# EAGLE design immo_programmer (EAGLE 9.6.2)
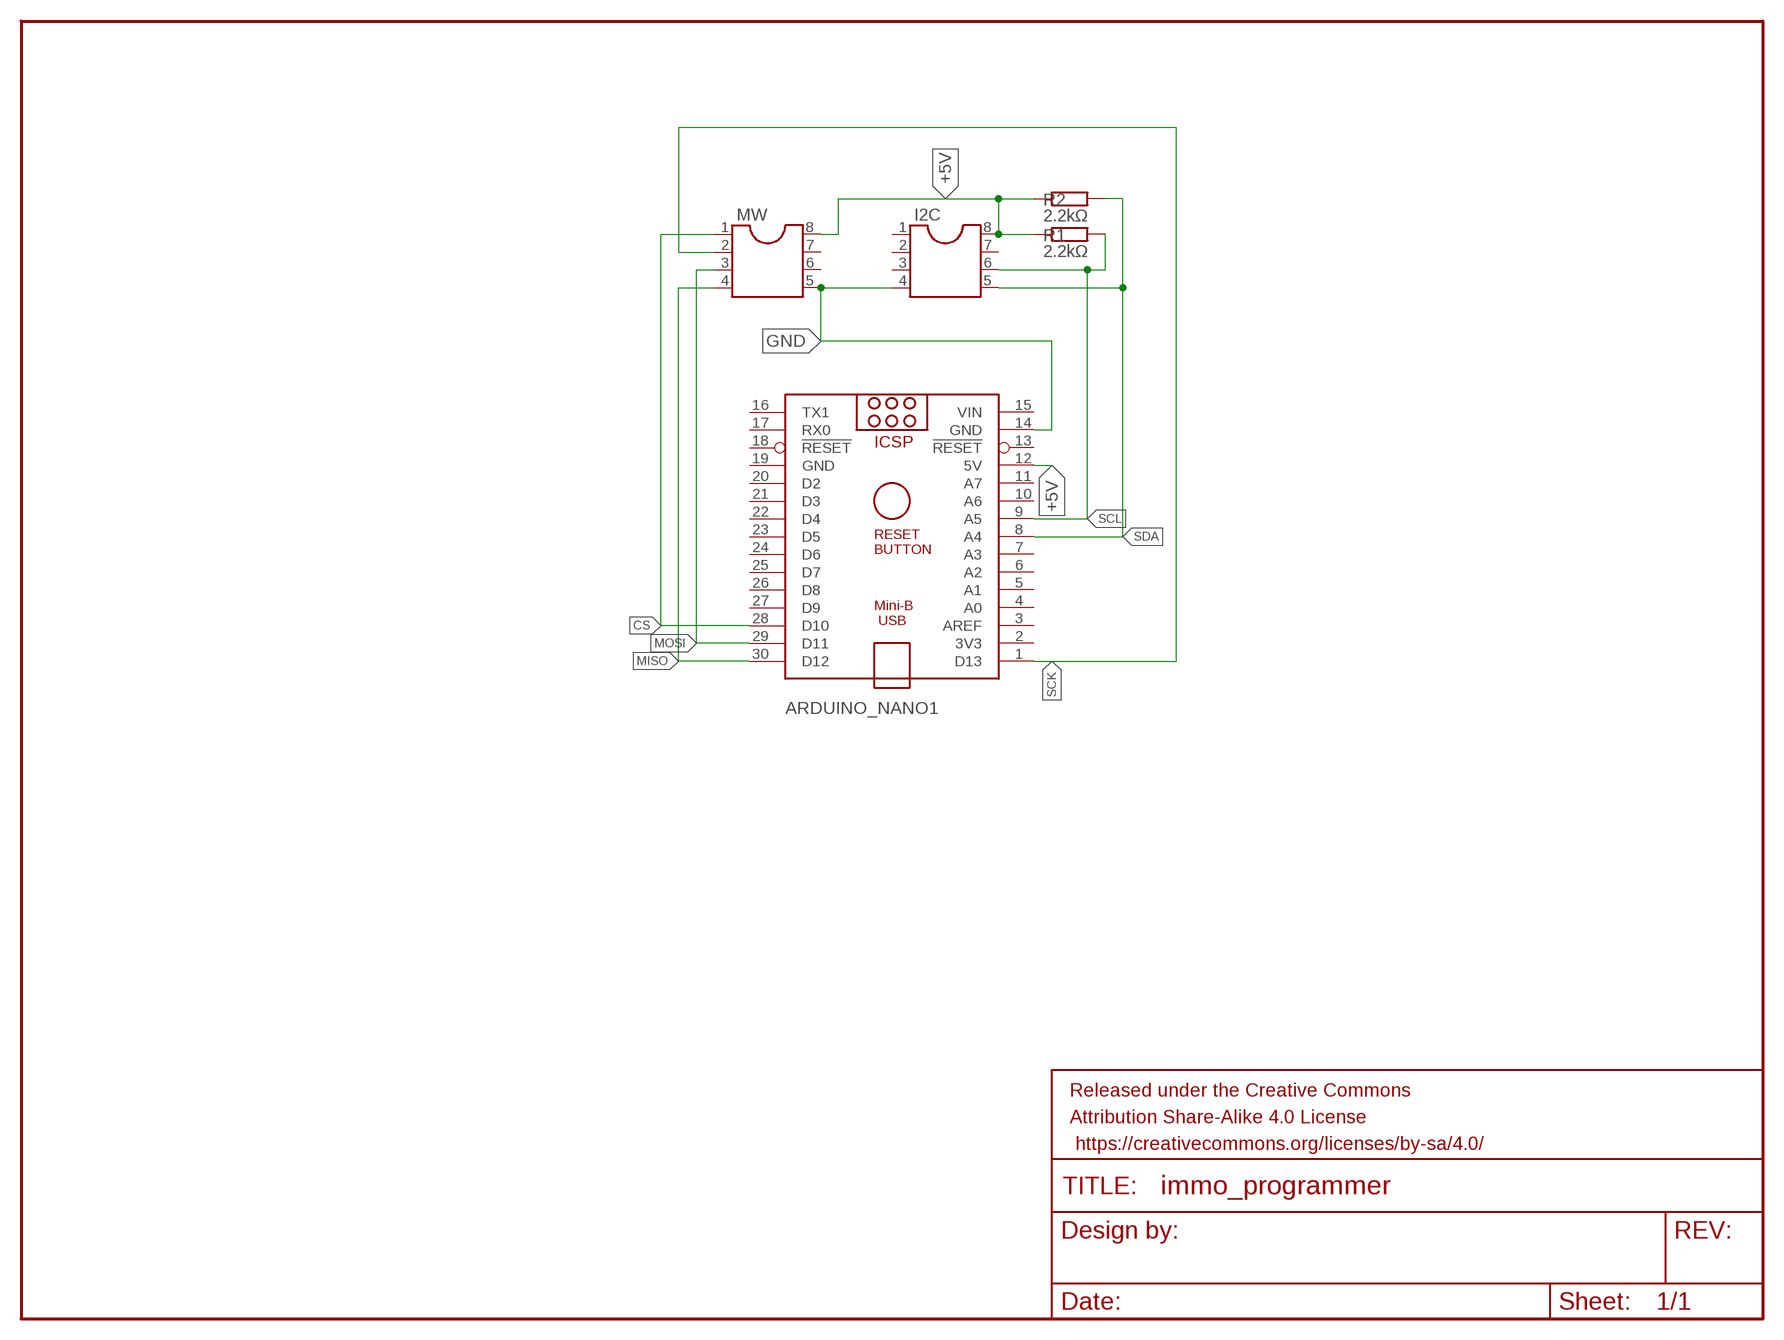
[diagram p0: schematic, sheet 1]

## Parts
ARDUINO_NANO1  ARDUINO_NANO  [ARDUINO_NANO]
FRAME1  FRAME-LETTER  [CREATIVE_COMMONS]
I2C  DIL8  [DIL08]
MW  DIL8  [DIL08]
R1  2.2kΩ  R0207/10  [0207/10]
R2  2.2kΩ  R0207/10  [0207/10]

## Nets
+5V: ARDUINO_NANO1.12(5V) I2C.8 MW.8 R1.1 R2.1
CS: ARDUINO_NANO1.28(D10) MW.1
GND: ARDUINO_NANO1.14(GND) I2C.4 MW.5
MISO: ARDUINO_NANO1.30(D12) MW.4
MOSI: ARDUINO_NANO1.29(D11) MW.3
SCK: ARDUINO_NANO1.1(D13) MW.2
SCL: ARDUINO_NANO1.9(A5) I2C.6 R1.2
SDA: ARDUINO_NANO1.8(A4) I2C.5 R2.2
Unconnected: ARDUINO_NANO1.2(3V3) ARDUINO_NANO1.3(AREF) ARDUINO_NANO1.4(A0) ARDUINO_NANO1.5(A1) ARDUINO_NANO1.6(A2) ARDUINO_NANO1.7(A3) ARDUINO_NANO1.10(A6) ARDUINO_NANO1.11(A7) ARDUINO_NANO1.13(!RESET) ARDUINO_NANO1.16(TX1) ARDUINO_NANO1.17(RX0) ARDUINO_NANO1.18(!RESET) ARDUINO_NANO1.20(D2) ARDUINO_NANO1.21(D3) ARDUINO_NANO1.22(D4) ARDUINO_NANO1.23(D5) ARDUINO_NANO1.24(D6) ARDUINO_NANO1.25(D7) ARDUINO_NANO1.26(D8) ARDUINO_NANO1.27(D9) I2C.1 I2C.2 I2C.3 I2C.7 MW.6 MW.7

## Power pins joined to a net without a drawn wire
GND: ARDUINO_NANO1.19(GND)
VIN: ARDUINO_NANO1.15(VIN)

## Library data of the parts
ARDUINO_NANO1 = ArduinoNanoV30:ARDUINO_NANO: Arduino Nano V3.0 Overview: The Arduino Nano is a small, complete, and breadboard-friendly board based on the ATmega328 (Arduino Nano 3.x) or ATmega168 (Arduino Nano 2.x). It has more or less the same functionality of the Arduino Duemilanove, but in a different package. It lacks only a DC power jack, and works with a Mini-B USB cable instead of a standard one. The Nano was designed and is being produced by Gravitech. Specifications: Microcontroller Atmel ATmega168 or ATmega328 Operating Voltage (logic level) 5 V Input Voltage (recommended) 7-12 V Input Voltage (limits) 6-20 V Digital I/O Pins 14 (of which 6 provide PWM output) Analog Input Pins 8 DC Current per I/O Pin 40 mA Flash Memory 16 KB (ATmega168) or 32 KB (ATmega328) of which 2 KB used by bootloader SRAM 1 KB (ATmega168) or 2 KB (ATmega328) EEPROM 512 bytes (ATmega168) or 1 KB (ATmega328) Clock Speed 16 MHz Dimensions 0.73" x 1.70" Length 45 mm Width 18 mm Weigth 5 g Power: The Arduino Nano can be powered via the Mini-B USB connection, 6-20V unregulated external power supply (pin 30), or 5V regulated external power supply (pin 27). The power source is automatically selected to the highest voltage source. Memory: The ATmega168 has 16 KB of flash memory for storing code (of which 2 KB is used for the bootloader); the ATmega328 has 32 KB, (also with 2 KB used for the bootloader). The ATmega168 has 1 KB of SRAM and 512 bytes of EEPROM (which can be read and written with the EEPROM library); the ATmega328 has 2 KB of SRAM and 1 KB of EEPROM. Input and Output: Each of the 14 digital pins on the Nano can be used as an input or output, using pinMode(), digitalWrite(), and digitalRead() functions. They operate at 5 volts. Each pin can provide or receive a maximum of 40 mA and has an internal pull-up resistor (disconnected by default) of 20-50 kOhms. In addition, some pins have specialized functions. Visit Arduino - ArduinoBoardNano <https://www.arduino.cc/en/Main/ArduinoBoardNano>
FRAME1 = SparkFun-Aesthetics:FRAME-LETTER: Schematic Frame - Letter Standard 8.5x11 US Letter frame
I2C MW = ic-package:DIL8: Dual In Line / Socket
R1 R2 = eagle-ltspice:R: RESISTOR, European symbol; SPICEMODEL: NONE; SPICEPREFIX: R

## Net classes
0 default: width 0.254 mm

## Board
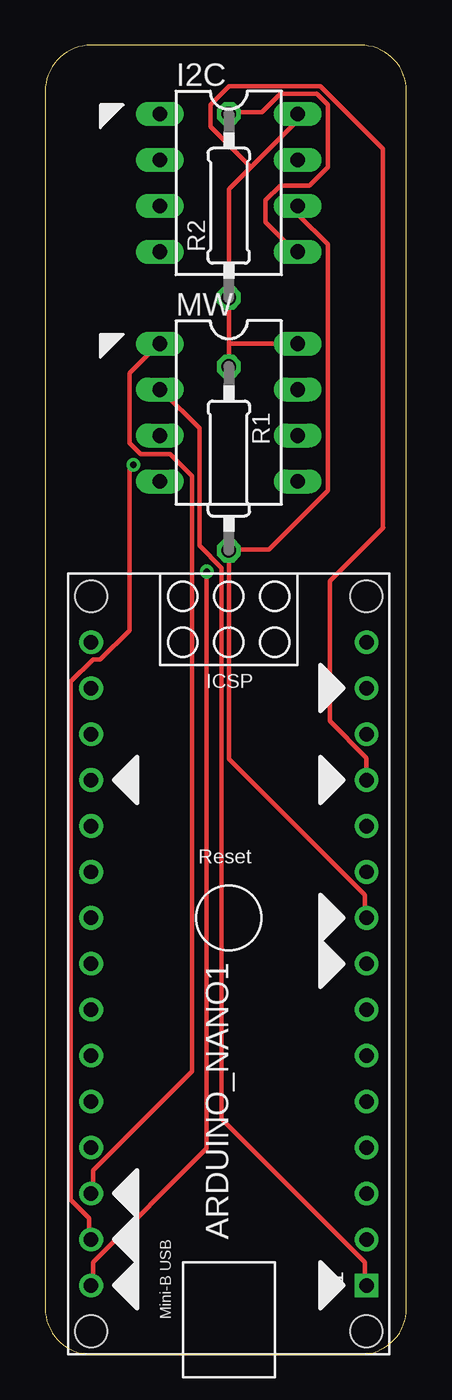
[diagram p1: board, top side]
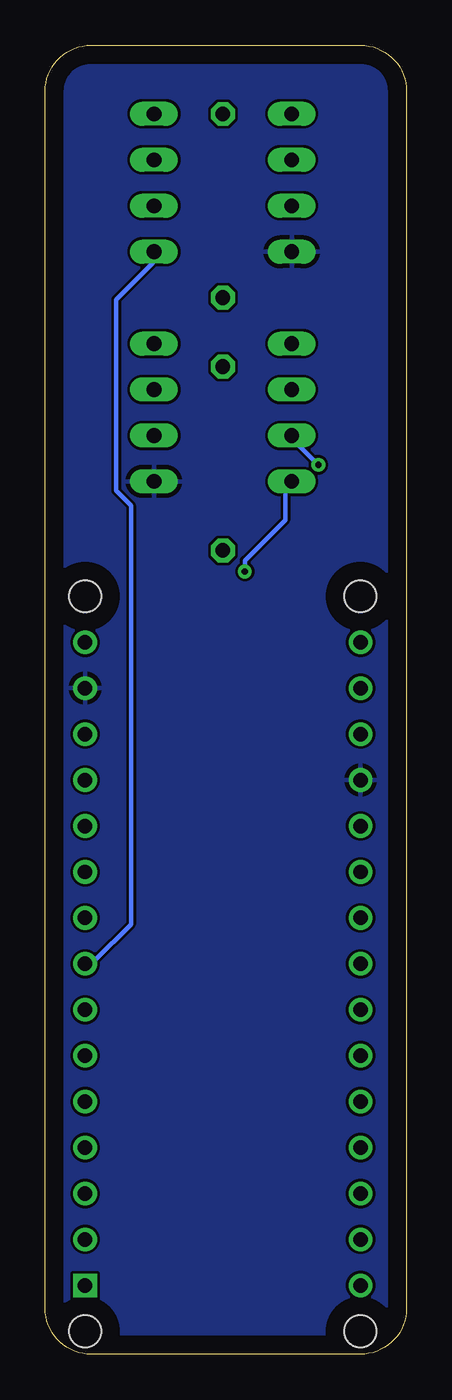
[diagram p2: board, bottom side, seen from below]

Size 19.99 x 72.38 mm. Coordinates in mm from the lower left corner, seen from the top.
Outline: 2.54,0 17.45,0 arc90 19.99,2.54 19.99,69.84 arc90 17.45,72.38 2.54,72.38 arc90 0,69.84 0,2.54 arc90 2.54,0
Copper layers (1*16): Top 0.035mm / dielectric 1.5mm / Bottom 0.035mm
Design rules "default": minimum track width 6mil, minimum drill 0.35mm, track to track 6mil, track to pad 6mil, pad to pad 6mil, via to via 6mil, smd to smd 6mil, copper to edge 40mil, drill to drill 6mil, minimum pad ring 10mil, minimum via ring 8mil, stop-mask expansion 4mil, vias tented up to drill 0mil, thermal gap 10mil

### Footprints (pad centres in the part's own frame; a part is rotated, then mirrored left to right if it is on the bottom)
ARDUINO_NANO = drill 0.8 square: 1 -20.32,-7.62 | drill 0.8: 2 -17.78,-7.62; 3 -15.24,-7.62; 4 -12.7,-7.62; 5 -10.16,-7.62; 6 -7.62,-7.62; 7 -5.08,-7.62; 8 -2.54,-7.62; 9 0,-7.62; 10 2.54,-7.62; 11 5.08,-7.62; 12 7.62,-7.62; 13 10.16,-7.62; 14 12.7,-7.62; 15 15.24,-7.62; 16 15.24,7.62; 17 12.7,7.62; 18 10.16,7.62; 19 7.62,7.62; 20 5.08,7.62; 21 2.54,7.62; 22 0,7.62; 23 -2.54,7.62; 24 -5.08,7.62; 25 -7.62,7.62; 26 -10.16,7.62; 27 -12.7,7.62; 28 -15.24,7.62; 29 -17.78,7.62; 30 -20.32,7.62 | hole 1.778: -22.86,-7.62; -22.86,7.62; 17.78,7.62; 17.78,-7.62
DIL08 = drill 0.813 long: 1 -3.81,-3.81; 2 -1.27,-3.81; 3 1.27,-3.81; 4 3.81,-3.81; 5 3.81,3.81; 6 1.27,3.81; 7 -1.27,3.81; 8 -3.81,3.81
0207/10 = drill 0.813 octagon: 1 -5.08,0; 2 5.08,0

### Placement (x,y rotation side)
ARDUINO_NANO1  10.16,24.13 90 top
FRAME1  21.59,83.82 0 top  (outside the outline)
I2C  10.16,64.77 270 top
MW  10.16,52.07 270 top
R1  10.16,49.53 270 top
R2  10.16,63.5 90 top

### Tracks (layer width: path | path; a pad name or v marks a point on that pad's centre or on a via)
+5V
  Top 0.254: 10.16,55.88 R2.1 10.16,64.41 11.38,65.63 | 10.16,55.88 R1.1 | 10.16,55.88 MW.8 | 11.38,65.63 13.82,68.07 13.82,68.48 I2C.8 | ARDUINO_NANO1.12 17.78,32.97 15.75,35 15.75,42.75 18.7,45.71 18.69,45.72 18.69,66.65 15.24,70.1 10.16,70.1 9.14,69.09 9.14,67.87 11.38,65.63
CS
  Top 0.254: ARDUINO_NANO1.28 2.64,8.94 2.64,10.16 8.13,15.65 8.13,48.56 6.91,49.78 5.28,49.78 4.67,50.39 4.67,54.25 6.3,55.88 MW.1
GND
  pour Bottom: 0,72.39 20.32,72.39 20.32,0 0,0
MISO  (via drill 0.35)
  Top 0.254: v8.94,43.28 8.94,11.38 2.64,5.08 2.64,3.86 ARDUINO_NANO1.30
  Bottom 0.254: v8.94,43.28 8.94,43.89 6.71,46.13 6.71,47.95 6.5,48.16 MW.4
MOSI  (via drill 0.35)
  Top 0.254: v4.88,49.17 4.67,48.97 4.67,40.03 3.05,38.41 2.64,38.41 1.42,37.19 1.42,8.53 2.44,7.52 2.44,6.5 ARDUINO_NANO1.29
  Bottom 0.254: v4.88,49.17 6.5,50.8 MW.3
SCK
  Top 0.254: ARDUINO_NANO1.1 17.68,3.86 17.68,5.08 9.75,13.01 9.75,43.48 8.53,44.7 8.53,51.21 6.5,53.24 MW.2
SCL
  Top 0.254: ARDUINO_NANO1.9 17.68,24.18 17.68,25.4 10.16,32.92 R1.2 10.16,44.5 12.39,44.5 15.65,47.75 15.65,61.37 14.02,62.99 14.02,63.4 I2C.6
SDA
  Top 0.254: R2.2 10.16,68.68 11.99,68.68 13.01,69.7 15.04,69.7 15.65,69.09 15.65,65.63 14.63,64.62 13.01,64.62 12.19,63.8 12.19,62.59 13.82,60.96 I2C.5
  Bottom 0.254: ARDUINO_NANO1.8 17.68,21.74 17.27,21.74 15.24,23.77 15.24,46.94 16.05,47.75 16.05,58.32 14.02,60.35 14.02,60.96 I2C.5